# EAGLE design readhead (EAGLE 6.4)
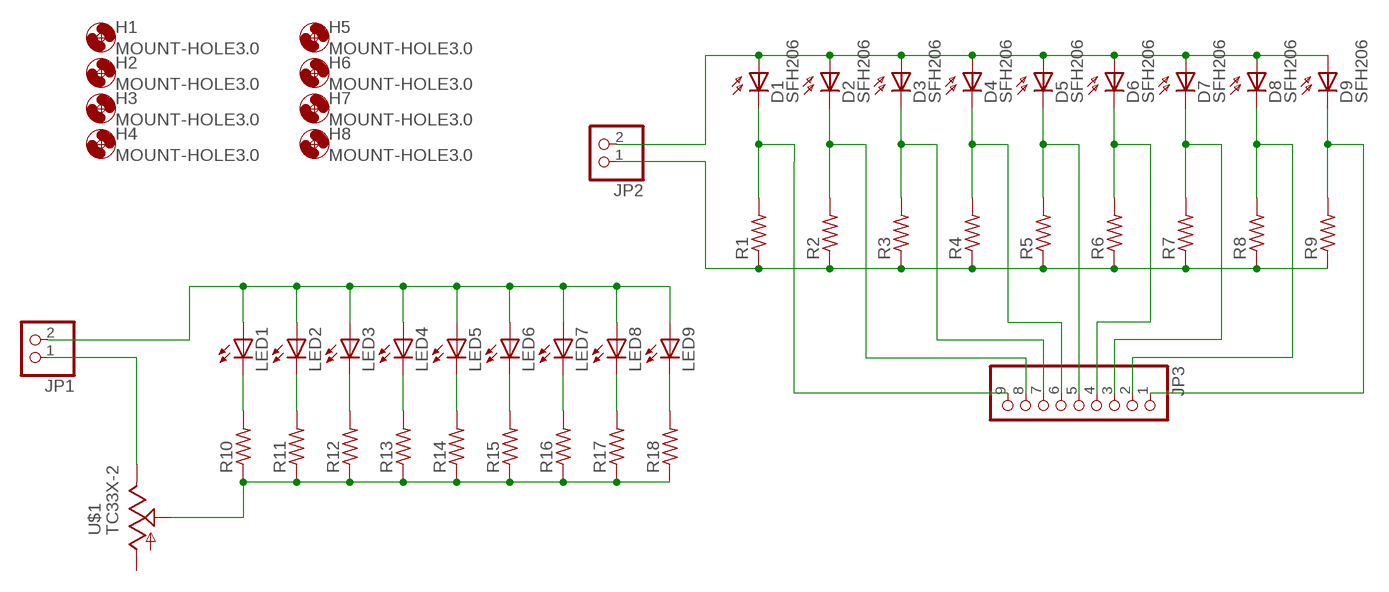
[diagram p0: schematic, sheet 1]

## Parts
D1  SFH206  [SFH206]
D2  SFH206  [SFH206]
D3  SFH206  [SFH206]
D4  SFH206  [SFH206]
D5  SFH206  [SFH206]
D6  SFH206  [SFH206]
D7  SFH206  [SFH206]
D8  SFH206  [SFH206]
D9  SFH206  [SFH206]
H1  MOUNT-HOLE3.0  [3,0]
H2  MOUNT-HOLE3.0  [3,0]
H3  MOUNT-HOLE3.0  [3,0]
H4  MOUNT-HOLE3.0  [3,0]
H5  MOUNT-HOLE3.0  [3,0]
H6  MOUNT-HOLE3.0  [3,0]
H7  MOUNT-HOLE3.0  [3,0]
H8  MOUNT-HOLE3.0  [3,0]
JP1  PINHD-1X2  [1X02]
JP2  PINHD-1X2  [1X02]
JP3  PINHD-1X9  [1X09]
LED1  LED5MM  [LED5MM]
LED2  LED5MM  [LED5MM]
LED3  LED5MM  [LED5MM]
LED4  LED5MM  [LED5MM]
LED5  LED5MM  [LED5MM]
LED6  LED5MM  [LED5MM]
LED7  LED5MM  [LED5MM]
LED8  LED5MM  [LED5MM]
LED9  LED5MM  [LED5MM]
R1  R-US_R0805  [R0805]
R2  R-US_R0805  [R0805]
R3  R-US_R0805  [R0805]
R4  R-US_R0805  [R0805]
R5  R-US_R0805  [R0805]
R6  R-US_R0805  [R0805]
R7  R-US_R0805  [R0805]
R8  R-US_R0805  [R0805]
R9  R-US_R0805  [R0805]
R10  R-US_R0805  [R0805]
R11  R-US_R0805  [R0805]
R12  R-US_R0805  [R0805]
R13  R-US_R0805  [R0805]
R14  R-US_R0805  [R0805]
R15  R-US_R0805  [R0805]
R16  R-US_R0805  [R0805]
R17  R-US_R0805  [R0805]
R18  R-US_R0805  [R0805]
U$1  TC33X-2  [TC33X-2]

## Nets
N$1: LED1.K(C) R10.2
N$2: LED2.K(C) R11.2
N$3: LED3.K(C) R12.2
N$4: LED4.K(C) R13.2
N$5: LED5.K(C) R14.2
N$6: LED6.K(C) R15.2
N$7: LED7.K(C) R16.2
N$8: LED8.K(C) R17.2
N$9: LED9.K(C) R18.2
N$10: D1.K(C) JP3.9 R1.2
N$11: D2.K(C) JP3.8 R2.2
N$12: D3.K(C) JP3.7 R3.2
N$13: D4.K(C) JP3.6 R4.2
N$14: D5.K(C) JP3.5 R5.2
N$15: D6.K(C) JP3.4 R6.2
N$16: D7.K(C) JP3.3 R7.2
N$17: D8.K(C) JP3.2 R8.2
N$18: D9.K(C) JP3.1 R9.2
N$19: JP2.1 R1.1 R2.1 R3.1 R4.1 R5.1 R6.1 R7.1 R8.1 R9.1
N$20: D1.A D2.A D3.A D4.A D5.A D6.A D7.A D8.A D9.A JP2.2
N$21: JP1.2 LED1.A LED2.A LED3.A LED4.A LED5.A LED6.A LED7.A LED8.A LED9.A
N$22: R10.1 R11.1 R12.1 R13.1 R14.1 R15.1 R16.1 R17.1 R18.1 U$1.P$2(S)
N$23: JP1.1 U$1.P$3(E)
Unconnected: U$1.P$1(A)

## Library data of the parts
D1-D9 = opto-trans-siemens:SFH206: PHOTO DIODE; MPN: SFH206K; OC_FARNELL: 1212741; OC_NEWARK: 01M8807
H1-H8 = holes:MOUNT-HOLE: MOUNTING HOLE with drill center marker
JP1 JP2 = pinhead:PINHD-1X2: PIN HEADER
JP3 = pinhead:PINHD-1X9: PIN HEADER
LED1-LED9 = adafruit:LED: LED OSRAM: - CHIPLED LG R971, LG N971, LY N971, LG Q971, LY Q971, LO R971, LY R971 LH N974, LH R974 LS Q976, LO Q976, LY Q976 LO Q996 - Hyper CHIPLED LW Q18S LB Q993, LB Q99A, LB R99A - SideLED LS A670, LO A670, LY A670, LG A670, LP A670 LB A673, LV A673, LT A673, LW A673 LH A674 LY A675 LS A676, LA A676, LO A676, LY A676, LW A676 LS A679, LY A679, LG A679 - Hyper Micro SIDELED® LS Y876, LA Y876, LO Y876, LY Y876 LT Y87S - SmartLED LW L88C, LW L88S LB L89C, LB L89S, LG L890 LS L89K, LO L89K, LY L89K LS L896, LA L896, LO L896, LY L896 - TOPLED LS T670, LO T670, LY T670, LG T670, LP T670 LSG T670, LSP T670, LSY T670, LOP T670, LYG T670 LG T671, LOG T671, LSG T671 LB T673, LV T673, LT T673, LW T673 LH T674 LS T676, LA T676, LO T676, LY T676, LB T676, LH T676, LSB T676, LW T676 LB T67C, LV T67C, LT T67C, LS T67K, LO T67K, LY T67K, LW E67C LS E67B, LA E67B, LO E67B, LY E67B, LB E67C, LV E67C, LT E67C LW T67C LS T679, LY T679, LG T679 LS T770, LO T770, LY T770, LG T770, LP T770 LB T773, LV T773, LT T773, LW T773 LH T774 LS E675, LA E675, LY E675, LS T675 LS T776, LA T776, LO T776, LY T776, LB T776 LHGB T686 LT T68C, LB T68C - Hyper Mini TOPLED® LB M676 - Mini TOPLED Santana® LG M470 LS M47K, LO M47K, LY M47K Source: http://www.osram.convergy.de/
R1-R18 = adafruit:R-US_: RESISTOR, American symbol
U$1 = vreg:TC33X-2

## Board
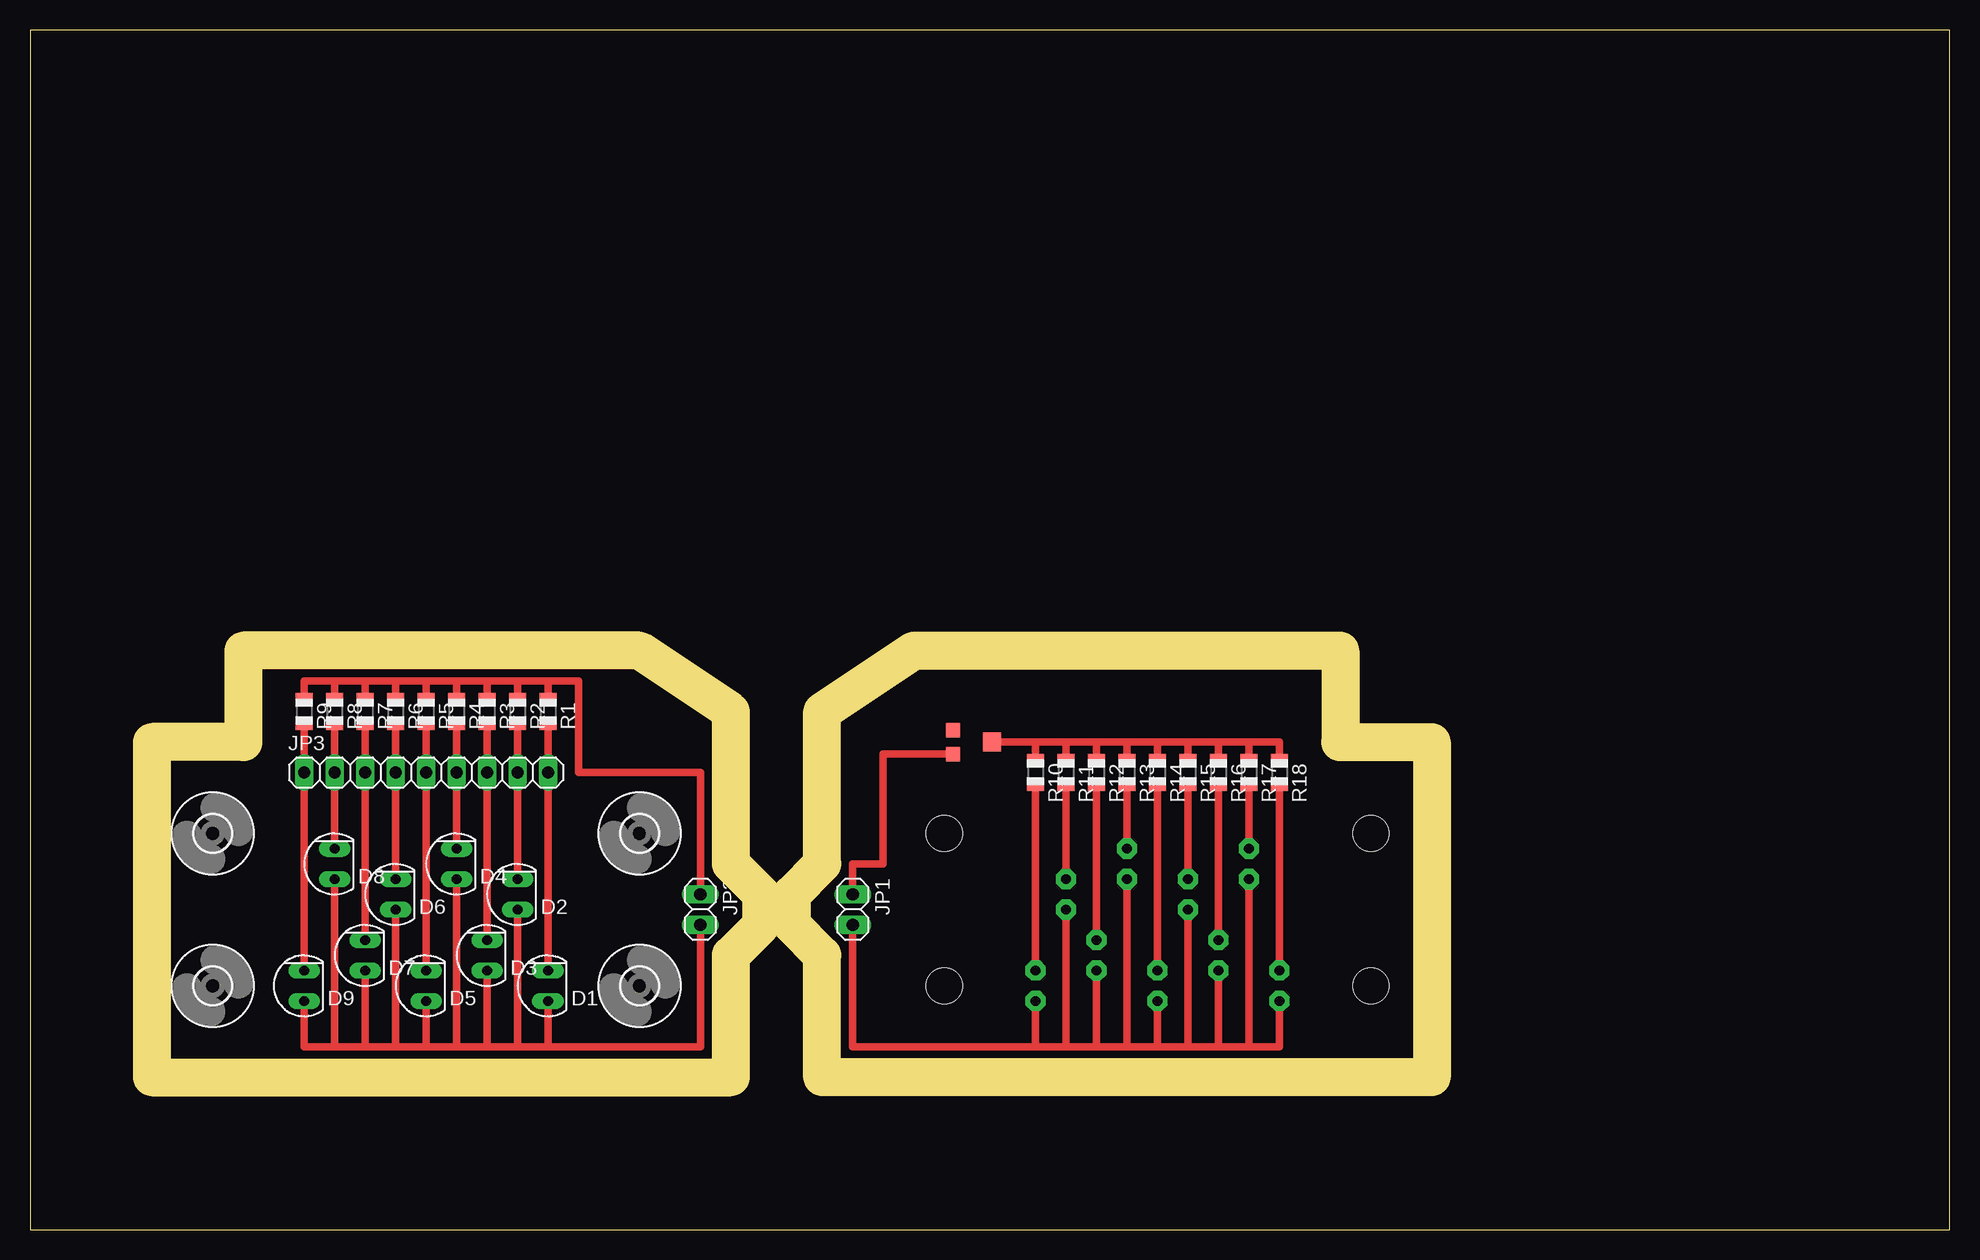
[diagram p1: board, top side]
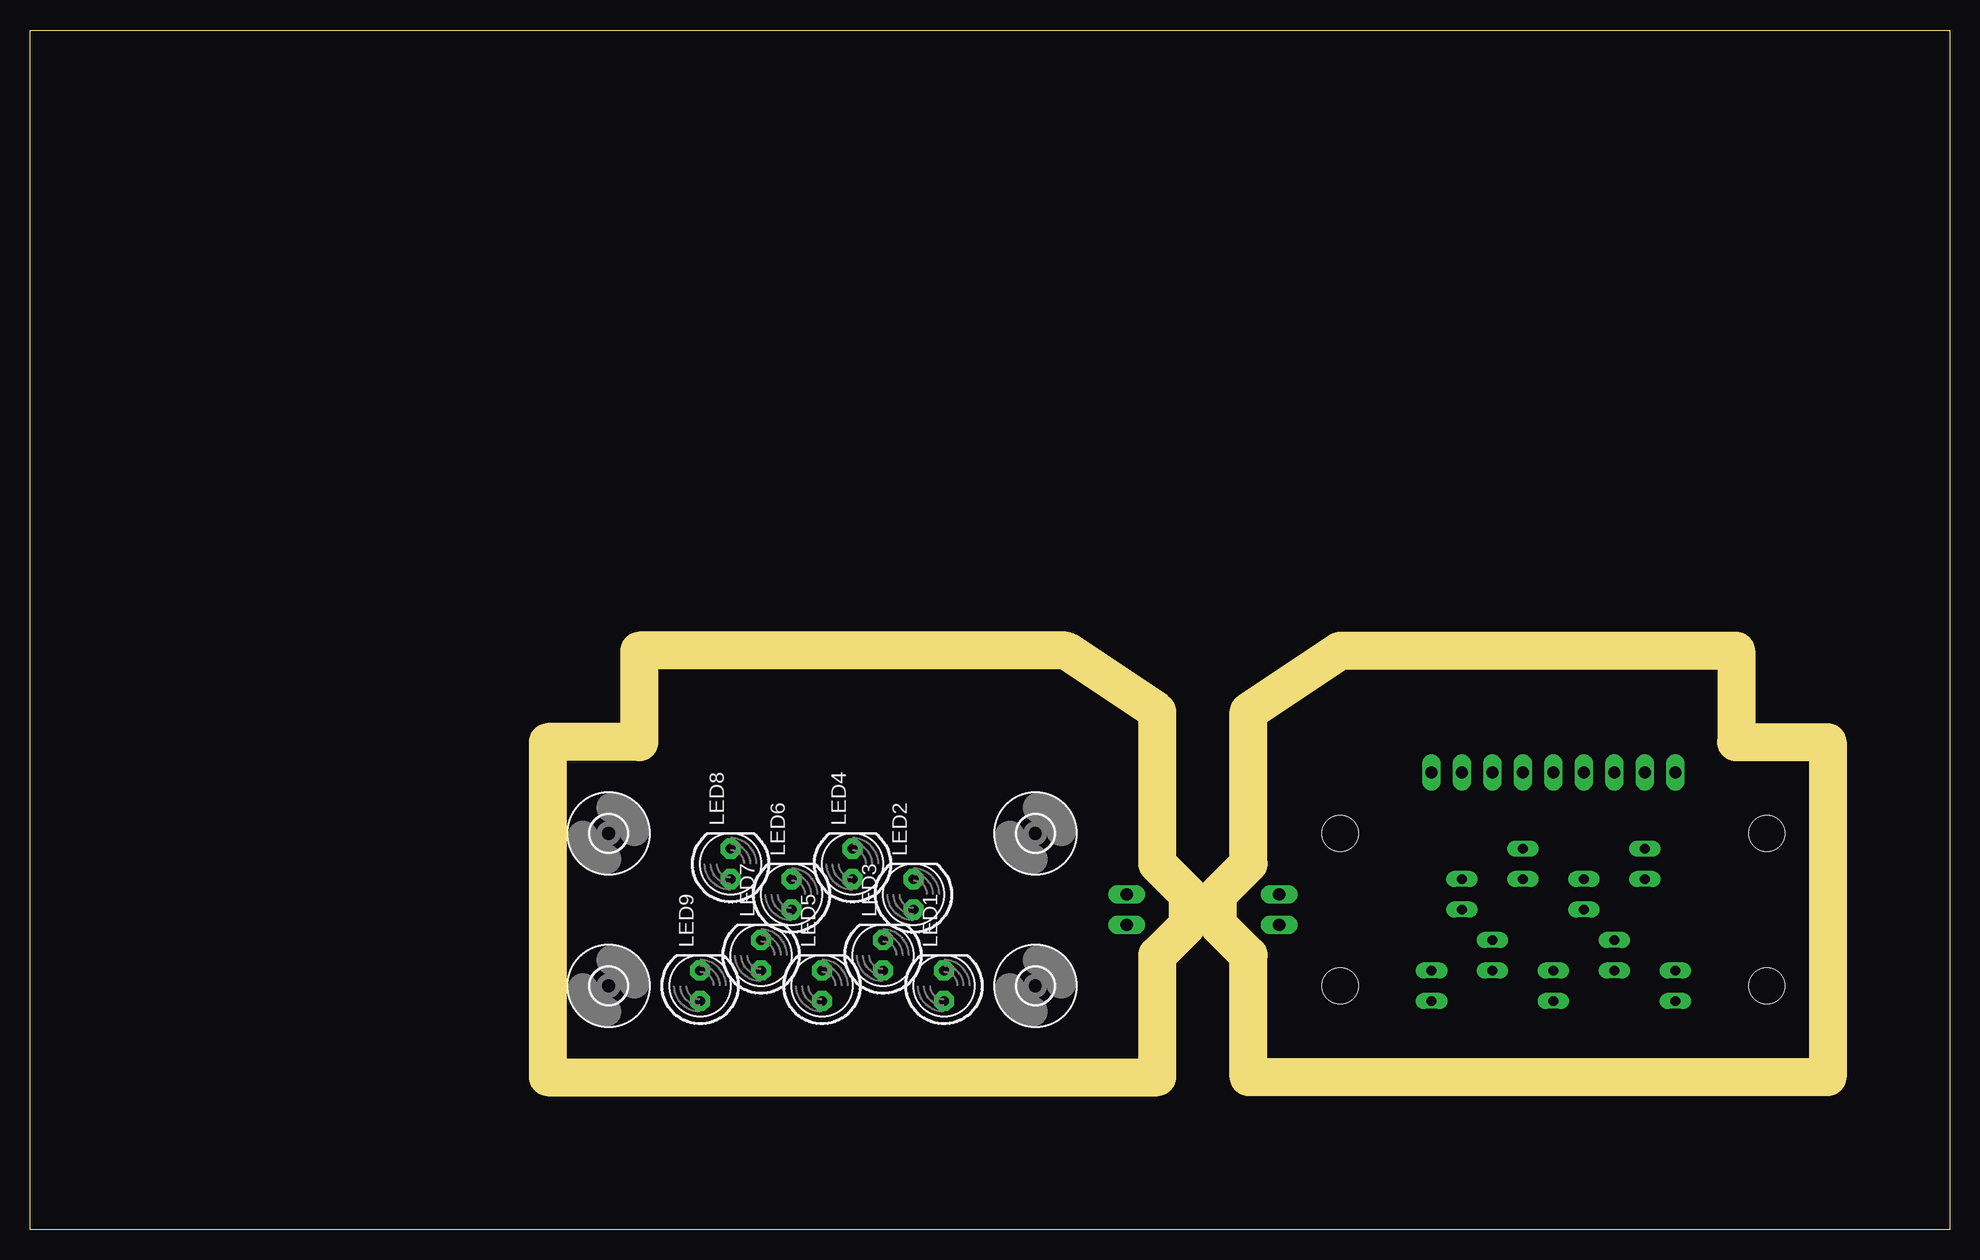
[diagram p2: board, bottom side, seen from below]

Size 160 x 100 mm. Coordinates in mm from the lower left corner, seen from the top.
Outline: 0,0 160,0 160,100 0,100 0,0
Copper layers (1*16): Top 0.035mm / dielectric 1.5mm / Bottom 0.035mm
Design rules "default": minimum track width 10mil, minimum drill 24mil, track to track 8mil, track to pad 8mil, pad to pad 8mil, via to via 8mil, smd to smd 8mil, copper to edge 40mil, drill to drill 8mil, minimum pad ring 10mil, minimum via ring 8mil, stop-mask expansion 4mil, vias tented up to drill 0mil, thermal gap 10mil
Milling: 22 lines

### Footprints (pad centres in the part's own frame; a part is rotated, then mirrored left to right if it is on the bottom)
SFH206 = drill 0.813 long: A 0,-1.27; K 0,1.27
3,0 = hole 3: 0,0
1X02 = drill 1.016 long: 1 -1.27,0; 2 1.27,0
1X09 = drill 1.016 long: 1 -10.16,0; 2 -7.62,0; 3 -5.08,0; 4 -2.54,0; 5 0,0; 6 2.54,0; 7 5.08,0; 8 7.62,0; 9 10.16,0
LED5MM = drill 0.813 pad 1.676 octagon: A -1.27,0; K 1.27,0
R0805 = smd 1.1 x 1.4: 1 -1,0; 2 1,0
TC33X-2 = smd 1.2 x 1.2: P$1 -1,-1.8; P$3 1,-1.8 | smd 1.6 x 1.5: P$2 0,1.45

### Placement (x,y rotation side)
D1  43.18,20.32 0 top
D2  40.64,27.94 0 top
D3  38.1,22.86 0 top
D4  35.56,30.48 0 top
D5  33.02,20.32 0 top
D6  30.48,27.94 0 top
D7  27.94,22.86 0 top
D8  25.4,30.48 0 top
D9  22.86,20.32 0 top
H1  15.24,20.32 0 top
H2  15.24,33.02 0 top
H3  50.8,20.32 0 top
H4  50.8,33.02 0 top
H5  76.2,33.02 0 bottom
H6  76.2,20.32 0 bottom
H7  111.76,20.32 0 bottom
H8  111.76,33.02 0 bottom
JP1  68.58,26.67 270 top
JP2  55.88,26.67 270 top
JP3  33.02,38.1 0 top
LED1  83.82,20.32 90 bottom
LED2  86.36,27.94 90 bottom
LED3  88.9,22.86 90 bottom
LED4  91.44,30.48 90 bottom
LED5  93.98,20.32 90 bottom
LED6  96.52,27.94 90 bottom
LED7  99.06,22.86 90 bottom
LED8  101.6,30.48 90 bottom
LED9  104.14,20.32 90 bottom
R1  43.18,43.18 270 top
R2  40.64,43.18 270 top
R3  38.1,43.18 270 top
R4  35.56,43.18 270 top
R5  33.02,43.18 270 top
R6  30.48,43.18 270 top
R7  27.94,43.18 270 top
R8  25.4,43.18 270 top
R9  22.86,43.18 270 top
R10  83.82,38.1 270 top
R11  86.36,38.1 270 top
R12  88.9,38.1 270 top
R13  91.44,38.1 270 top
R14  93.98,38.1 270 top
R15  96.52,38.1 270 top
R16  99.06,38.1 270 top
R17  101.6,38.1 270 top
R18  104.14,38.1 270 top
U$1  78.74,40.64 270 top

### Tracks (layer width: path | path; a pad name or v marks a point on that pad's centre or on a via)
N$1
  Top 0.61: R10.2 LED1.K
N$2
  Top 0.61: LED2.K R11.2
N$3
  Top 0.61: R12.2 LED3.K
N$4
  Top 0.61: LED4.K R13.2
N$5
  Top 0.61: R14.2 LED5.K
N$6
  Top 0.61: LED6.K R15.2
N$7
  Top 0.61: R16.2 LED7.K
N$8
  Top 0.61: R17.2 LED8.K
N$9
  Top 0.61: R18.2 LED9.K
N$10
  Top 0.61: R1.2 JP3.9 D1.K
N$11
  Top 0.61: R2.2 JP3.8 D2.K
N$12
  Top 0.61: R3.2 JP3.7 D3.K
N$13
  Top 0.61: R4.2 JP3.6 D4.K
N$14
  Top 0.61: R5.2 JP3.5 D5.K
N$15
  Top 0.61: R6.2 JP3.4 D6.K
N$16
  Top 0.61: R7.2 JP3.3 D7.K
N$17
  Top 0.61: R8.2 JP3.2 D8.K
N$18
  Top 0.61: R9.2 JP3.1 D9.K
N$19
  Top 0.61: JP2.1 55.88,35.56 55.88,38.1 45.72,38.1 45.72,45.72 43.18,45.72 | 43.18,45.72 R1.1 | R9.1 22.86,45.72 25.4,45.72 | 25.4,45.72 R8.1 | R7.1 27.94,45.72 | 27.94,45.72 25.4,45.72 | R6.1 30.48,45.72 | 30.48,45.72 27.94,45.72 | R5.1 33.02,45.72 | 33.02,45.72 30.48,45.72 | R4.1 35.56,45.72 | 35.56,45.72 33.02,45.72 | R3.1 38.1,45.72 | 38.1,45.72 35.56,45.72 | 40.64,45.72 R2.1 40.64,45.72 | 40.64,45.72 38.1,45.72 | 40.64,45.72 43.18,45.72
N$20
  Top 0.61: JP2.2 55.88,15.24 43.18,15.24 | 43.18,15.24 D1.A | D2.A 40.64,15.24 | 40.64,15.24 43.18,15.24 | D3.A 38.1,15.24 | 38.1,15.24 40.64,15.24 | D4.A 35.56,15.24 | 35.56,15.24 38.1,15.24 | D5.A 33.02,15.24 | 33.02,15.24 35.56,15.24 | D6.A 30.48,15.24 | 30.48,15.24 33.02,15.24 | D7.A 27.94,15.24 | 27.94,15.24 30.48,15.24 | D8.A 25.4,15.24 | 25.4,15.24 27.94,15.24 | D9.A 22.86,15.24 25.4,15.24
N$21
  Top 0.61: JP1.2 68.58,15.24 83.82,15.24 | 83.82,15.24 LED1.A | LED3.A 88.9,15.24 | 88.9,15.24 86.36,15.24 | 86.36,15.24 83.82,15.24 | LED9.A 104.14,15.24 101.6,15.24 | 101.6,15.24 99.06,15.24 | 99.06,15.24 96.52,15.24 | 96.52,15.24 93.98,15.24 | 93.98,15.24 91.44,15.24 | 91.44,15.24 88.9,15.24 | LED8.A 101.6,15.24 | LED7.A 99.06,15.24 | LED6.A 96.52,15.24 | LED5.A 93.98,15.24 | LED2.A 86.36,15.24 | LED4.A 91.44,15.24
N$22
  Top 0.61: U$1.P$2 83.82,40.64 | 83.82,40.64 R10.1 | R11.1 86.36,40.64 | 86.36,40.64 83.82,40.64 | R18.1 104.14,40.64 101.6,40.64 | 101.6,40.64 99.06,40.64 | 99.06,40.64 96.52,40.64 | 96.52,40.64 93.98,40.64 | 93.98,40.64 91.44,40.64 | 91.44,40.64 88.9,40.64 | 88.9,40.64 86.36,40.64 | R17.1 101.6,40.64 | R16.1 99.06,40.64 | R15.1 96.52,40.64 | R14.1 93.98,40.64 | R13.1 91.44,40.64 | R12.1 88.9,40.64
N$23
  Top 0.61: JP1.1 68.58,30.48 71.12,30.48 71.12,39.64 U$1.P$3